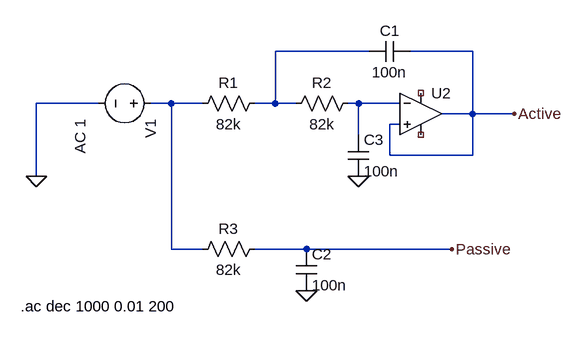
[diagram p0: schematic 6.asc]
6.asc, the LTspice schematic file:
Version 4
SHEET 1 888 680
WIRE 576 -160 432 -160
WIRE 736 -160 640 -160
WIRE 160 -80 64 -80
WIRE 272 -80 240 -80
WIRE 320 -80 272 -80
WIRE 432 -80 432 -160
WIRE 432 -80 400 -80
WIRE 464 -80 432 -80
WIRE 560 -80 544 -80
WIRE 624 -80 560 -80
WIRE 736 -64 736 -160
WIRE 736 -64 688 -64
WIRE 800 -64 736 -64
WIRE 624 -48 608 -48
WIRE 560 -32 560 -80
WIRE 608 0 608 -48
WIRE 736 0 736 -64
WIRE 736 0 608 0
WIRE 64 32 64 -80
WIRE 272 144 272 -80
WIRE 320 144 272 144
WIRE 480 144 400 144
WIRE 704 144 480 144
FLAG 64 32 0
FLAG 560 32 0
FLAG 480 208 0
FLAG 800 -64 Active
FLAG 704 144 Passive
SYMBOL voltage 256 -80 R90
WINDOW 3 24 152 Left 2
WINDOW 123 24 124 Left 2
WINDOW 39 0 0 Left 0
SYMATTR InstName V1
SYMATTR Value ""
SYMATTR Value2 AC 1
SYMBOL res 416 -96 R90
WINDOW 0 0 56 VBottom 2
WINDOW 3 32 56 VTop 2
SYMATTR InstName R1
SYMATTR Value 82k
SYMBOL res 560 -96 R90
WINDOW 0 0 56 VBottom 2
WINDOW 3 32 56 VTop 2
SYMATTR InstName R2
SYMATTR Value 82k
SYMBOL res 416 128 R90
WINDOW 0 0 56 VBottom 2
WINDOW 3 32 56 VTop 2
SYMATTR InstName R3
SYMATTR Value 82k
SYMBOL cap 640 -176 R90
WINDOW 0 0 32 VBottom 2
WINDOW 3 32 32 VTop 2
SYMATTR InstName C1
SYMATTR Value 100n
SYMBOL cap 464 144 R0
SYMATTR InstName C2
SYMATTR Value 100n
SYMBOL cap 544 -32 R0
SYMATTR InstName C3
SYMATTR Value 100n
SYMBOL OpAmps\\UniversalOpAmp1 656 -64 R0
SYMATTR InstName U2
TEXT 40 232 Left 2 !.ac dec 1000 0.01 200

The netlist it stands for:
* 6.asc
V1 N002 0 AC 1
R1 N001 N002 82k
R2 N003 N001 82k
R3 Passive N002 82k
C1 Active N001 100n
C2 Passive 0 100n
C3 N003 0 100n
XU2 Active N003 NC_01 NC_02 Active level1 Avol=1Meg GBW=10Meg Vos=0 En=0 Enk=0 In=0 Ink=0 Rin=500Meg  ; pins In+ In- V+ V- OUT
.ac dec 1000 0.01 200
.lib UniversalOpAmp1.lib
.backanno
.end